# EAGLE schematic cubex_duo_mainboard_sch_step_dir (EAGLE 9.3.2)
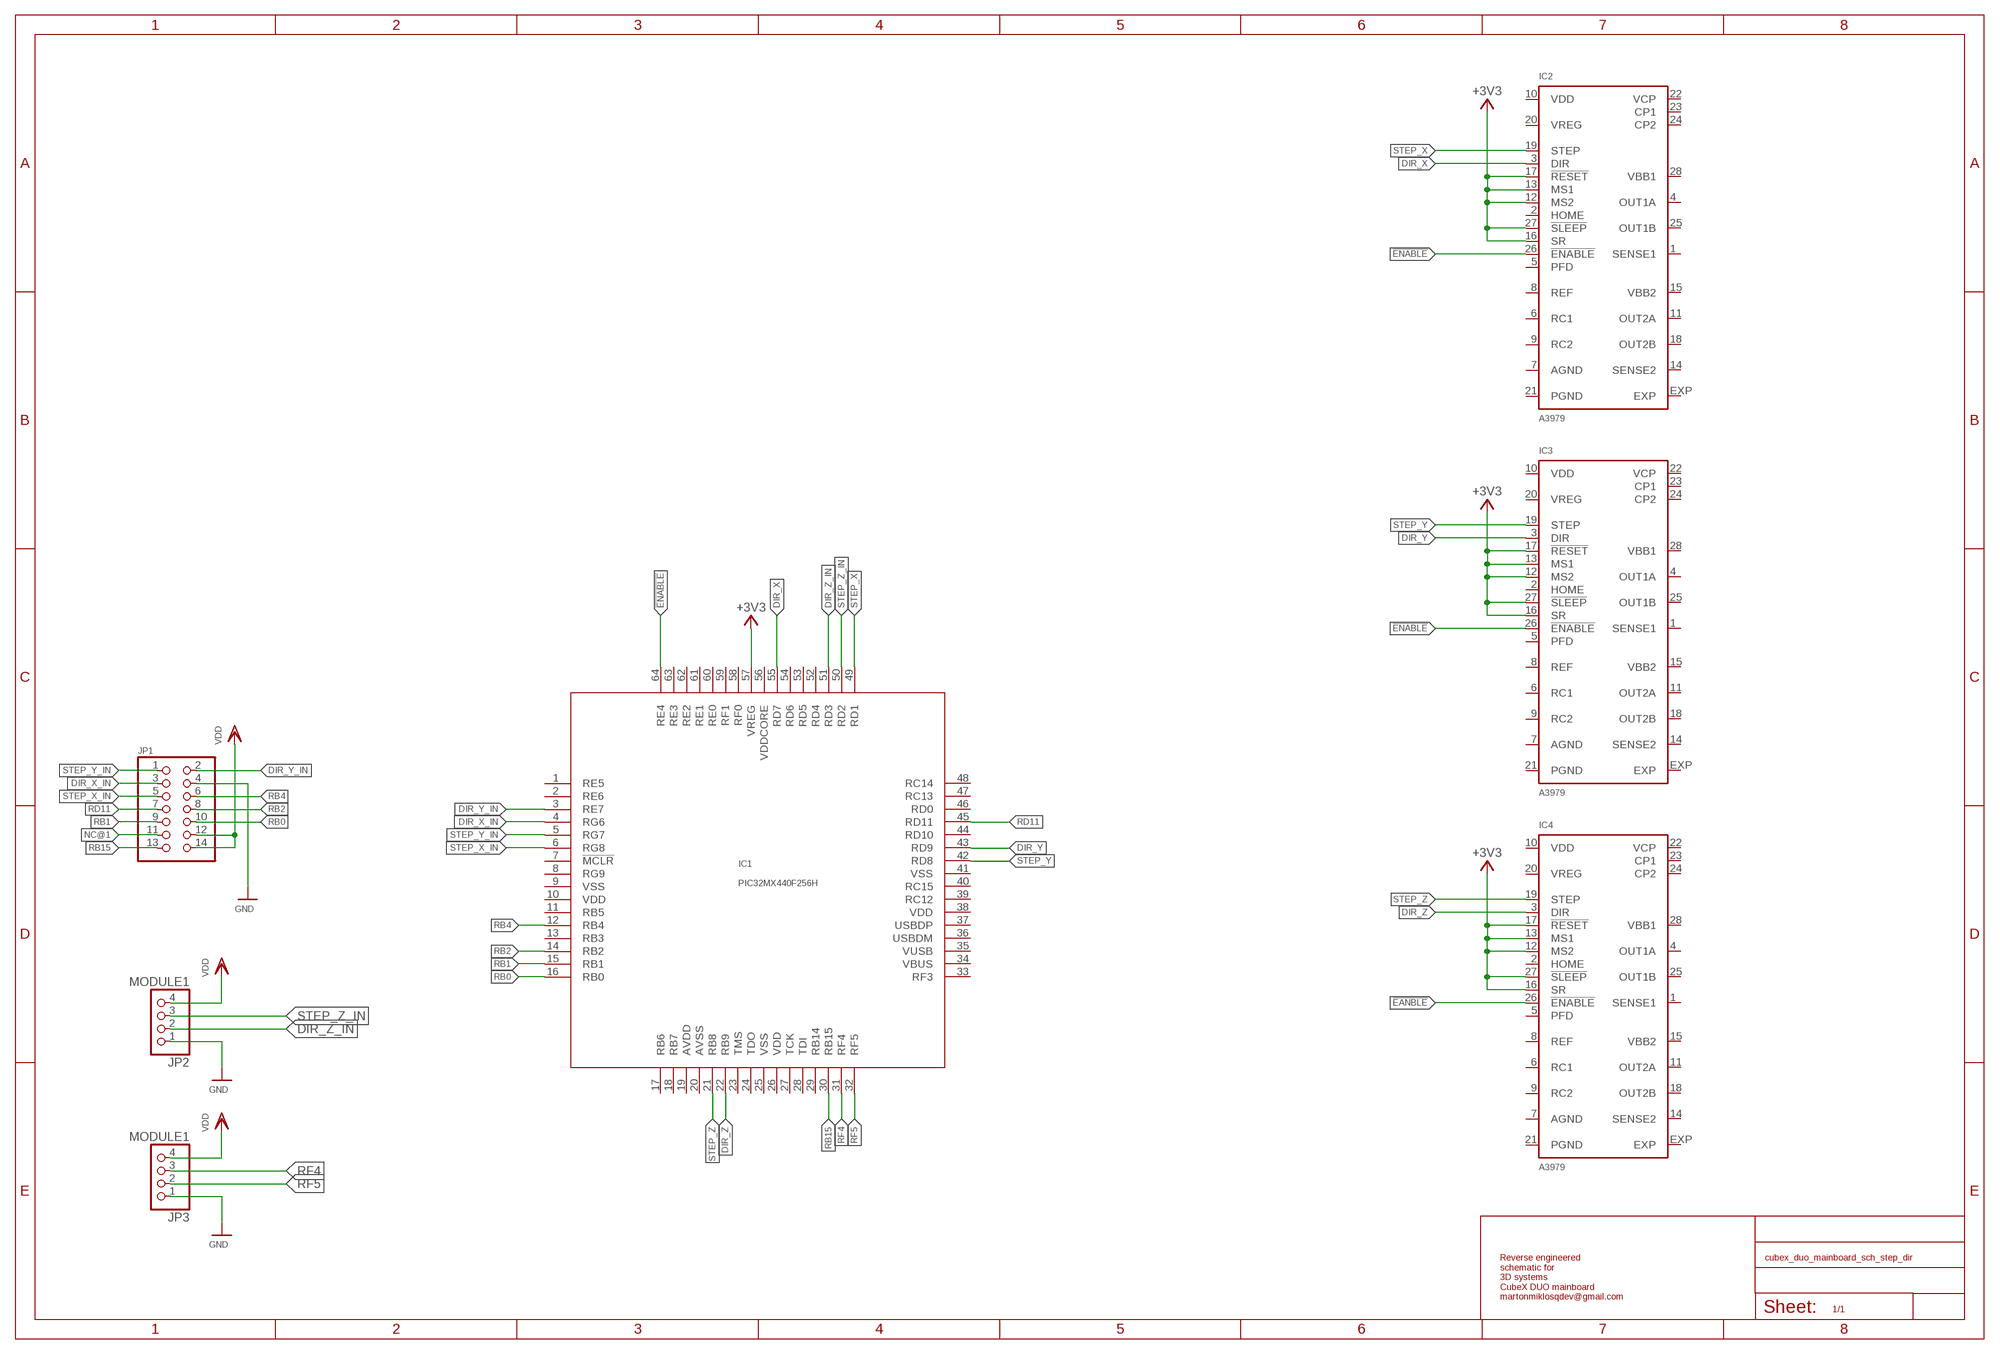
[diagram p0: schematic, sheet 1]

## Parts
IC1  PIC32MX440F256H  [TQFP64-10X10]
IC2  A3979  [TSSOP28]
IC3  A3979  [TSSOP28]
IC4  A3979  [TSSOP28]
JP1  PINHD-2X7  [2X07]
JP2  MODULE1  PINHD-1X4  [1X04]
JP3  MODULE1  PINHD-1X4  [1X04]

## Nets
!EANBLE: IC4.26(!ENABLE)
!ENABLE: IC1.64(RE4) IC2.26(!ENABLE) IC3.26(!ENABLE)
+3V3: IC1.57(VREG) IC2.12(MS2) IC2.13(MS1) IC2.16(SR) IC2.17(!RESET) IC2.27(!SLEEP) IC3.12(MS2) IC3.13(MS1) IC3.16(SR) IC3.17(!RESET) IC3.27(!SLEEP) IC4.12(MS2) IC4.13(MS1) IC4.16(SR) IC4.17(!RESET) IC4.27(!SLEEP)
DIR_X: IC1.55(RD7) IC2.3(DIR)
DIR_X_IN: IC1.4(RG6) JP1.3
DIR_Y: IC1.43(RD9) IC3.3(DIR)
DIR_Y_IN: IC1.3(RE7) JP1.2
DIR_Z: IC1.22(RB9) IC4.3(DIR)
DIR_Z_IN: IC1.51(RD3) JP2.2
GND: JP1.4 JP2.1 JP3.1
NC@1: JP1.11
RB0: IC1.16(RB0) JP1.10
RB1: IC1.15(RB1) JP1.9
RB2: IC1.14(RB2) JP1.8
RB4: IC1.12(RB4) JP1.6
RB15: IC1.30(RB15) JP1.13
RD11: IC1.45(RD11) JP1.7
RF4: IC1.31(RF4) JP3.3
RF5: IC1.32(RF5) JP3.2
STEP_X: IC1.49(RD1) IC2.19(STEP)
STEP_X_IN: IC1.6(RG8) JP1.5
STEP_Y: IC1.42(RD8) IC3.19(STEP)
STEP_Y_IN: IC1.5(RG7) JP1.1
STEP_Z: IC1.21(RB8) IC4.19(STEP)
STEP_Z_IN: IC1.50(RD2) JP2.3
VDD: JP1.12 JP1.14 JP2.4 JP3.4
Unconnected: IC1.1(RE5) IC1.2(RE6) IC1.7(!MCLR) IC1.8(RG9) IC1.11(RB5) IC1.13(RB3) IC1.17(RB6) IC1.18(RB7) IC1.23(TMS) IC1.24(TDO) IC1.27(TCK) IC1.28(TDI) IC1.29(RB14) IC1.33(RF3) IC1.34(VBUS) IC1.35(VUSB) IC1.36(USBDM) IC1.37(USBDP) IC1.39(RC12) IC1.40(RC15) IC1.44(RD10) IC1.46(RD0) IC1.47(RC13) IC1.48(RC14) IC1.52(RD4) IC1.53(RD5) IC1.54(RD6) IC1.58(RF0) IC1.59(RF1) IC1.60(RE0) IC1.61(RE1) IC1.62(RE2) IC1.63(RE3) IC2.1(SENSE1) IC2.2(HOME) IC2.4(OUT1A) IC2.5(PFD) IC2.6(RC1) IC2.8(REF) IC2.9(RC2) IC2.11(OUT2A) IC2.14(SENSE2) IC2.18(OUT2B) IC2.22(VCP) IC2.23(CP1) IC2.24(CP2) IC2.25(OUT1B) IC3.1(SENSE1) IC3.2(HOME) IC3.4(OUT1A) IC3.5(PFD) IC3.6(RC1) IC3.8(REF) IC3.9(RC2) IC3.11(OUT2A) IC3.14(SENSE2) IC3.18(OUT2B) IC3.22(VCP) IC3.23(CP1) IC3.24(CP2) IC3.25(OUT1B) IC4.1(SENSE1) IC4.2(HOME) IC4.4(OUT1A) IC4.5(PFD) IC4.6(RC1) IC4.8(REF) IC4.9(RC2) IC4.11(OUT2A) IC4.14(SENSE2) IC4.18(OUT2B) IC4.22(VCP) IC4.23(CP1) IC4.24(CP2) IC4.25(OUT1B)

## Notes on the sheet
- Reverse engineered
  schematic for 
  3D systems
  CubeX DUO mainboard
  martonmiklosqdev@gmail.com

## Power pins joined to a net without a drawn wire
AGND: IC2.7(AGND) IC3.7(AGND) IC4.7(AGND)
AVDD: IC1.19(AVDD)
AVSS: IC1.20(AVSS)
EXP: IC2.EXP IC3.EXP IC4.EXP
PGND: IC2.21(PGND) IC3.21(PGND) IC4.21(PGND)
VBB1: IC2.28(VBB1) IC3.28(VBB1) IC4.28(VBB1)
VBB2: IC2.15(VBB2) IC3.15(VBB2) IC4.15(VBB2)
VDD: IC1.10(VDD) IC1.26(VDD) IC1.38(VDD) IC2.10(VDD) IC3.10(VDD) IC4.10(VDD)
VDDCORE: IC1.56(VDDCORE)
VREG: IC2.20(VREG) IC3.20(VREG) IC4.20(VREG)
VSS: IC1.9(VSS) IC1.25(VSS) IC1.41(VSS)

## Library data of the parts
IC1 = microchip:PIC32MX440F256H: PIC32MX440F256H edit this description Auto generated by make-symbol-device-package-bsdl.ulp Rev. 25 Source: PIC32MX440F256H.bsdl; MPN: PIC32MX440F256H-80I/PT; OC_FARNELL: 1778947; OC_NEWARK: 98M1935
IC2-IC4 = linear:A3979: Microstepping DMOS Driver with Translator Source: http://allegromicro.com/datafile/3979.pdf
JP1 = pinhead:PINHD-2X7: PIN HEADER
JP2 JP3 = pinhead:PINHD-1X4: PIN HEADER